# Altium schematic sheet 01_Block_Diagram.SchDoc
size A4; SheetNumber: 1; SheetTotal: 4
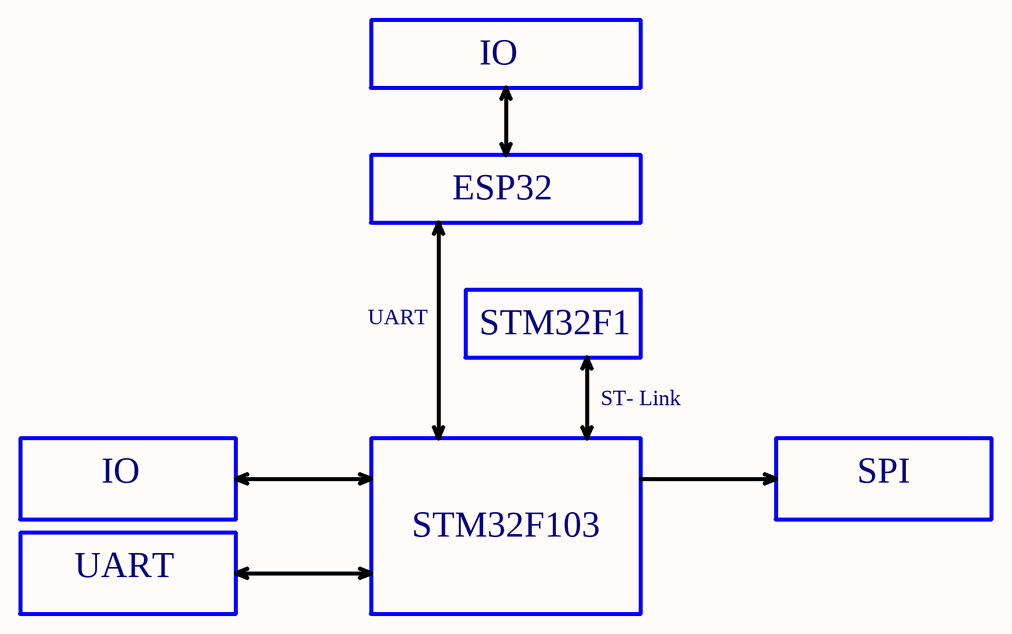
[diagram p0: 01_Block_Diagram.SchDoc]

## Notes on the sheet
- IO
- ESP32
- UART
- STM32F1
- ST- Link
- SPI
- STM32F103